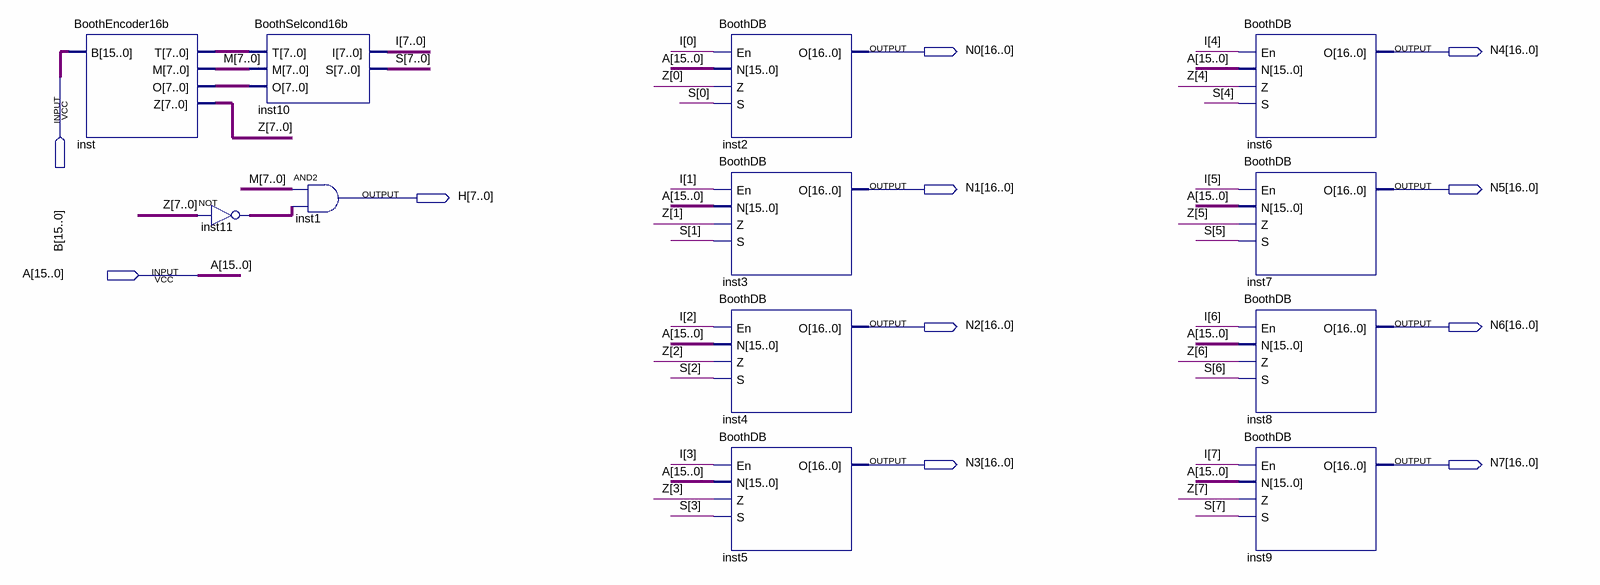
[diagram p0: schematic sheet]
// Quartus schematic BoothRadix4.bdf as structural Verilog: 12 symbols, 11 pins
module BoothRadix4 (
  input  [15:0] B,
  input  [15:0] A,
  output [16:0] N0,
  output [16:0] N4,
  output [16:0] N1,
  output [16:0] N5,
  output [7:0] H,
  output [16:0] N2,
  output [16:0] N6,
  output [16:0] N3,
  output [16:0] N7
);

  wire [7:0] I, inst11_out, inst_o, inst_t, M, S, Z;

  BoothEncoder16b inst (.B(B), .T(inst_t), .M(M), .O(inst_o), .Z(Z));
  assign inst11_out = ~Z;  // NOT inst11, 8 bits wide
  BoothSelcond16b inst10 (.T(inst_t), .M(M), .O(inst_o), .I(I), .S(S));
  assign H = M & inst11_out;  // AND2 inst1, 8 bits wide
  BoothDB inst2 (.En(I[0]), .N(A), .Z(Z[0]), .S(S[0]), .O(N0));
  BoothDB inst3 (.En(I[1]), .N(A), .Z(Z[1]), .S(S[1]), .O(N1));
  BoothDB inst4 (.En(I[2]), .N(A), .Z(Z[2]), .S(S[2]), .O(N2));
  BoothDB inst5 (.En(I[3]), .N(A), .Z(Z[3]), .S(S[3]), .O(N3));
  BoothDB inst6 (.En(I[4]), .N(A), .Z(Z[4]), .S(S[4]), .O(N4));
  BoothDB inst7 (.En(I[5]), .N(A), .Z(Z[5]), .S(S[5]), .O(N5));
  BoothDB inst8 (.En(I[6]), .N(A), .Z(Z[6]), .S(S[6]), .O(N6));
  BoothDB inst9 (.En(I[7]), .N(A), .Z(Z[7]), .S(S[7]), .O(N7));
endmodule
